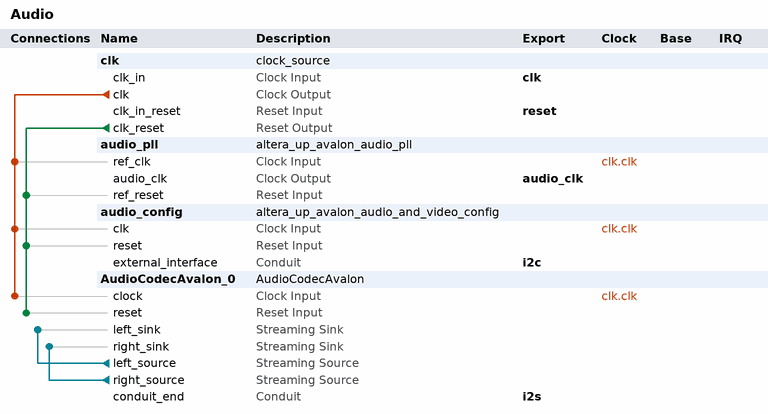
[diagram p0: system contents]
# Platform Designer (Qsys) system Audio, Cyclone V 5CSEMA5F31C7
# Parameters at their usual value, and those the tool derives, are not listed.
package require -exact qsys 16.1
create_system Audio
set_project_property DEVICE_FAMILY {Cyclone V}
set_project_property DEVICE 5CSEMA5F31C7

add_instance clk clock_source 16.1
set_instance_parameter_value clk clockFrequency 50000000

add_instance audio_pll altera_up_avalon_audio_pll 16.1
set_instance_parameter_value audio_pll gui_refclk 50.0

add_instance audio_config altera_up_avalon_audio_and_video_config 16.1
set_instance_parameter_value audio_config audio_in {Line In to ADC}
set_instance_parameter_value audio_config bit_length 24
set_instance_parameter_value audio_config board DE1-SoC
set_instance_parameter_value audio_config line_in_bypass false
set_instance_parameter_value audio_config sampling_rate {48 kHz}

add_instance AudioCodecAvalon_0 AudioCodecAvalon 1.0
set_instance_parameter_value AudioCodecAvalon_0 gDataWidth 24

# connections
add_connection clk.clk audio_config.clk clock
add_connection clk.clk audio_pll.ref_clk clock
add_connection clk.clk AudioCodecAvalon_0.clock clock
add_connection clk.clk_reset audio_config.reset reset
add_connection clk.clk_reset audio_pll.ref_reset reset
add_connection clk.clk_reset AudioCodecAvalon_0.reset reset
add_connection AudioCodecAvalon_0.left_source AudioCodecAvalon_0.left_sink avalon_streaming
add_connection AudioCodecAvalon_0.right_source AudioCodecAvalon_0.right_sink avalon_streaming

# exported interfaces
add_interface audio_clk clock source
set_interface_property audio_clk EXPORT_OF audio_pll.audio_clk
add_interface clk clock sink
set_interface_property clk EXPORT_OF clk.clk_in
add_interface i2c conduit end
set_interface_property i2c EXPORT_OF audio_config.external_interface
add_interface i2s conduit end
set_interface_property i2s EXPORT_OF AudioCodecAvalon_0.conduit_end
add_interface reset reset sink
set_interface_property reset EXPORT_OF clk.clk_in_reset

set_interconnect_requirement {$system} qsys_mm.clockCrossingAdapter HANDSHAKE
set_interconnect_requirement {$system} qsys_mm.enableEccProtection FALSE
set_interconnect_requirement {$system} qsys_mm.insertDefaultSlave FALSE
set_interconnect_requirement {$system} qsys_mm.maxAdditionalLatency 1

save_system Audio.qsys
